# EAGLE schematic scoreboard1 (EAGLE 7.2.0)

## Sheet 1 of 2
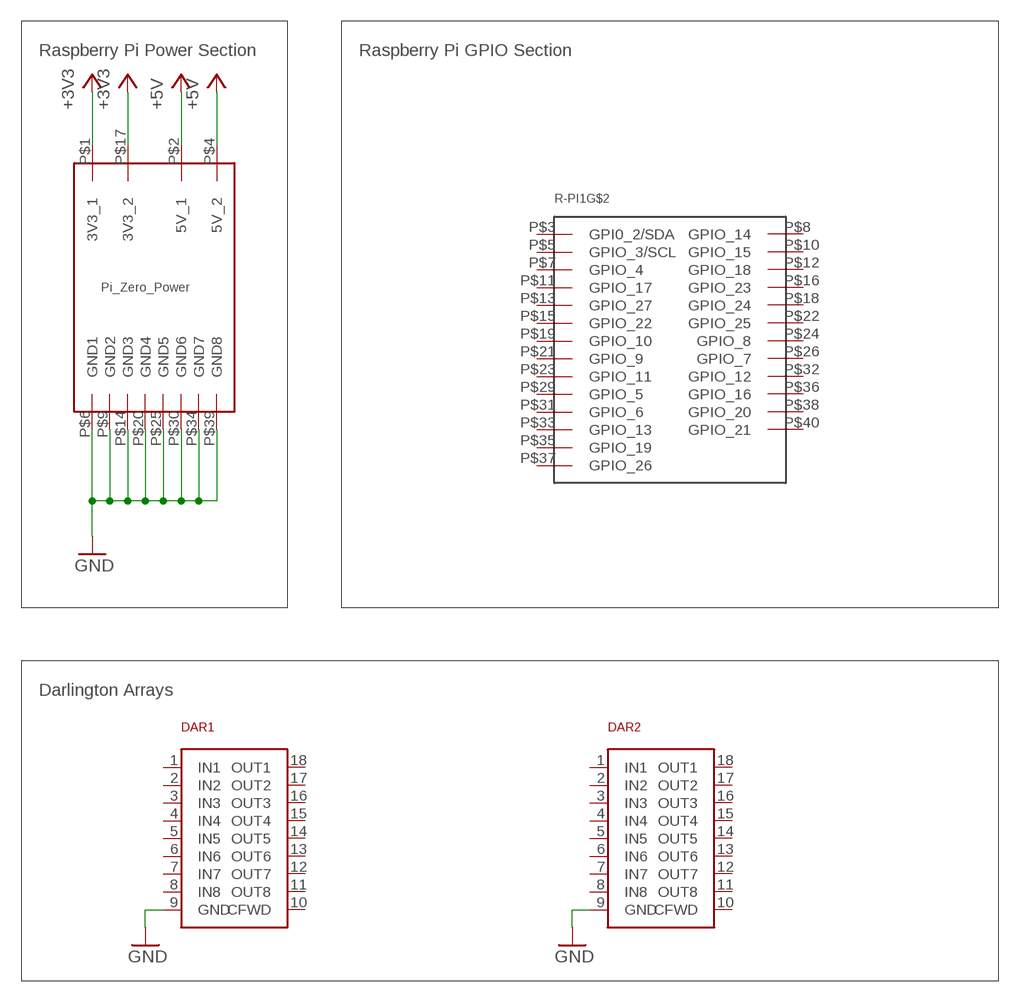
[diagram p0: schematic, sheet 1]

### Parts
DAR1  ULN2803A  [DIP18]
DAR2  ULN2803A  [DIP18]
R-PI1  PI_ZERO_POWER_AND_GPIO  [R_PI_ZERO_FOOTPRINT]

### Nets
+3V3: R-PI1.P$1(3V3_1) R-PI1.P$17(3V3_2) ; also sheet 2
+5V: R-PI1.P$2(5V_1) R-PI1.P$4(5V_2)
GND: DAR1.9(GND) DAR2.9(GND) R-PI1.P$6(GND1) R-PI1.P$9(GND2) R-PI1.P$14(GND3) R-PI1.P$20(GND4) R-PI1.P$25(GND5) R-PI1.P$30(GND6) R-PI1.P$34(GND7) R-PI1.P$39(GND8) ; also sheet 2
Unconnected: DAR1.1(IN1) DAR1.2(IN2) DAR1.3(IN3) DAR1.4(IN4) DAR1.5(IN5) DAR1.6(IN6) DAR1.7(IN7) DAR1.8(IN8) DAR1.10(CFWD) DAR1.11(OUT8) DAR1.12(OUT7) DAR1.13(OUT6) DAR1.14(OUT5) DAR1.15(OUT4) DAR1.16(OUT3) DAR1.17(OUT2) DAR1.18(OUT1) DAR2.1(IN1) DAR2.2(IN2) DAR2.3(IN3) DAR2.4(IN4) DAR2.5(IN5) DAR2.6(IN6) DAR2.7(IN7) DAR2.8(IN8) DAR2.10(CFWD) DAR2.11(OUT8) DAR2.12(OUT7) DAR2.13(OUT6) DAR2.14(OUT5) DAR2.15(OUT4) DAR2.16(OUT3) DAR2.17(OUT2) DAR2.18(OUT1) R-PI1.P$3(GPI0_2/SDA) R-PI1.P$5(GPIO_3/SCL) R-PI1.P$7(GPIO_4) R-PI1.P$8(GPIO_14) R-PI1.P$10(GPIO_15) R-PI1.P$11(GPIO_17) R-PI1.P$12(GPIO_18) R-PI1.P$13(GPIO_27) R-PI1.P$15(GPIO_22) R-PI1.P$16(GPIO_23) R-PI1.P$18(GPIO_24) R-PI1.P$19(GPIO_10) R-PI1.P$21(GPIO_9) R-PI1.P$22(GPIO_25) R-PI1.P$23(GPIO_11) R-PI1.P$24(GPIO_8) R-PI1.P$26(GPIO_7) R-PI1.P$29(GPIO_5) R-PI1.P$31(GPIO_6) R-PI1.P$32(GPIO_12) R-PI1.P$33(GPIO_13) R-PI1.P$35(GPIO_19) R-PI1.P$36(GPIO_16) R-PI1.P$37(GPIO_26) R-PI1.P$38(GPIO_20) R-PI1.P$40(GPIO_21)

### Notes on the sheet
- Raspberry Pi Power Section | Raspberry Pi GPIO Section
- Darlington Arrays

## Sheet 2 of 2
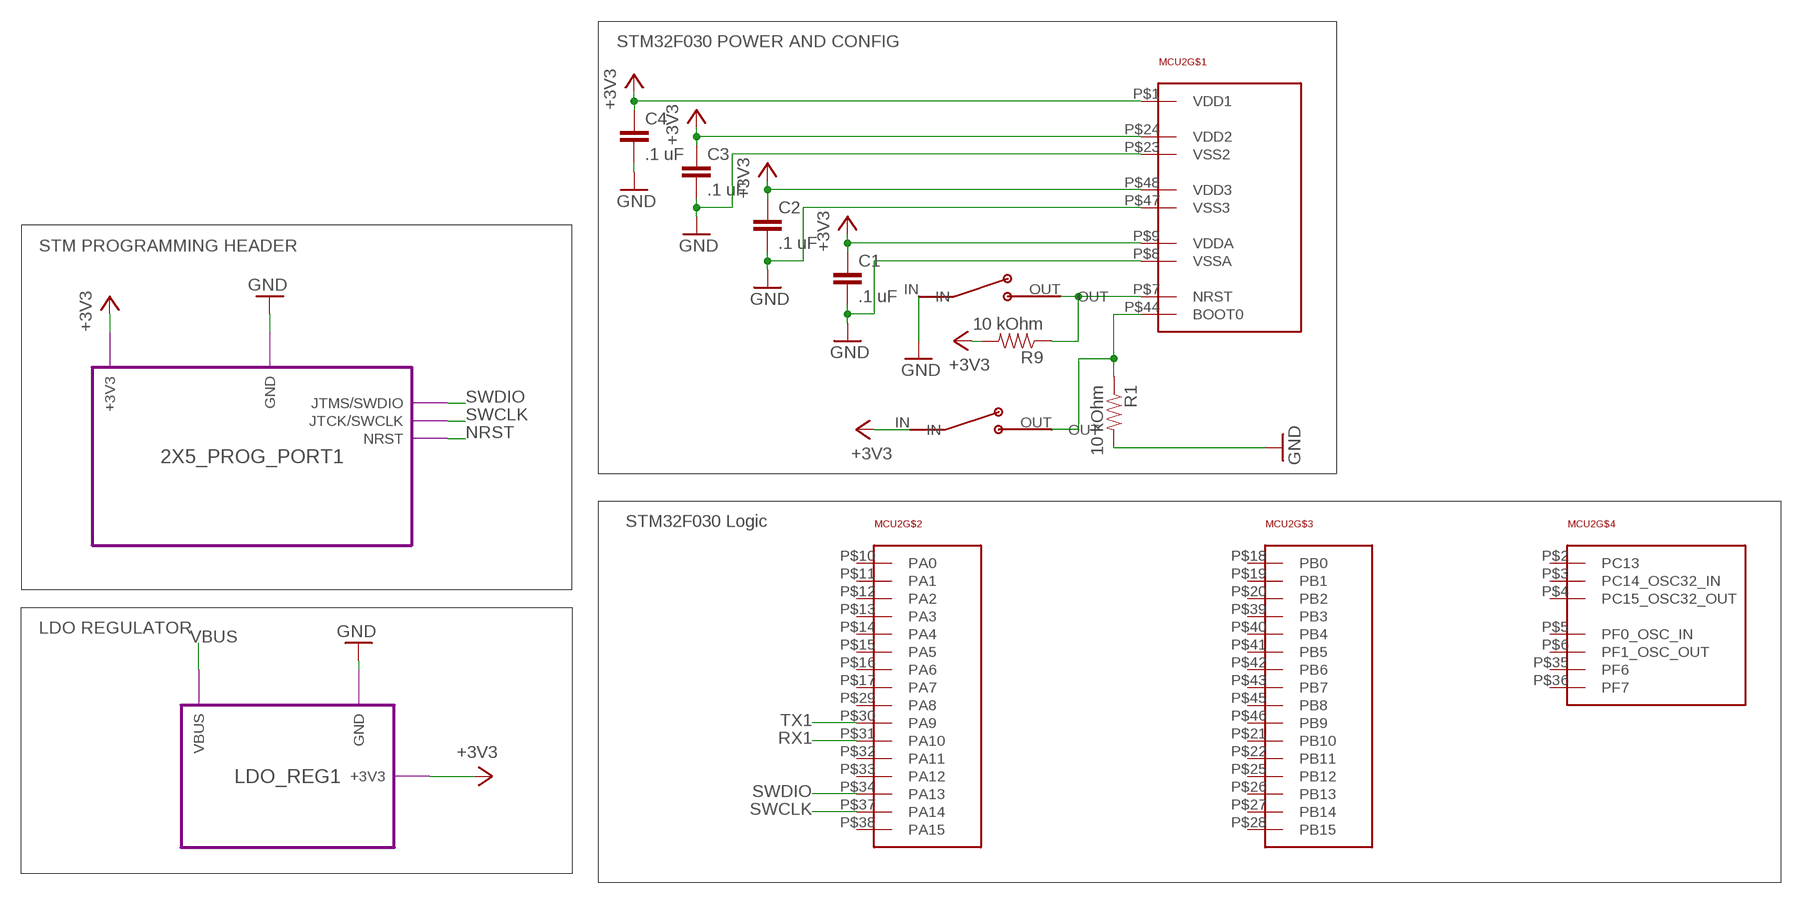
[diagram p1: schematic, sheet 2]

### Parts
BOOT0  OMRON_B3U-1000P-B  [B3U-1000P-B]
BOOT1  OMRON_B3U-1000P-B  [B3U-1000P-B]
C1  .1 uF  0402_CAP_NON_POLAR  [0402_CAP]
C2  .1 uF  0402_CAP_NON_POLAR  [0402_CAP]
C3  .1 uF  0402_CAP_NON_POLAR  [0402_CAP]
C4  .1 uF  0402_CAP_NON_POLAR  [0402_CAP]
MCU2  STM32F030C6TCTR  [LQFP-48]
R1  10 kOhm  0402_RESISTOR  [0402_RES]
R9  10 kOhm  0402_RESISTOR  [0402_RES]

### Module instances
2X5_PROG_PORT1 = 2X5_PROG_PORT
LDO_REG1 = LDO_REG

### Nets
+3V3: BOOT1.IN C1.P$1 C2.P$1 C3.P$1 C4.P$1 MCU2.P$1(VDD1) MCU2.P$9(VDDA) MCU2.P$24(VDD2) MCU2.P$48(VDD3) R9.P$2 ; port 2X5_PROG_PORT1.+3V3 LDO_REG1.+3V3 ; also sheet 1
GND: BOOT0.IN C1.P$2 C2.P$2 C3.P$2 C4.P$2 MCU2.P$8(VSSA) MCU2.P$23(VSS2) MCU2.P$47(VSS3) R1.P$2 ; port 2X5_PROG_PORT1.GND LDO_REG1.GND ; also sheet 1
NRST: BOOT0.OUT MCU2.P$7(NRST) R9.P$1 ; port 2X5_PROG_PORT1.NRST
NRST1: BOOT1.OUT MCU2.P$44(BOOT0) R1.P$1
RX1: MCU2.P$31(PA10)
SWCLK: MCU2.P$37(PA14) ; port 2X5_PROG_PORT1.JTCK/SWCLK
SWDIO: MCU2.P$34(PA13) ; port 2X5_PROG_PORT1.JTMS/SWDIO
TX1: MCU2.P$30(PA9)
VBUS: port LDO_REG1.VBUS
Unconnected: MCU2.P$2(PC13) MCU2.P$3(PC14_OSC32_IN) MCU2.P$4(PC15_OSC32_OUT) MCU2.P$5(PF0_OSC_IN) MCU2.P$6(PF1_OSC_OUT) MCU2.P$10(PA0) MCU2.P$11(PA1) MCU2.P$12(PA2) MCU2.P$13(PA3) MCU2.P$14(PA4) MCU2.P$15(PA5) MCU2.P$16(PA6) MCU2.P$17(PA7) MCU2.P$18(PB0) MCU2.P$19(PB1) MCU2.P$20(PB2) MCU2.P$21(PB10) MCU2.P$22(PB11) MCU2.P$25(PB12) MCU2.P$26(PB13) MCU2.P$27(PB14) MCU2.P$28(PB15) MCU2.P$29(PA8) MCU2.P$32(PA11) MCU2.P$33(PA12) MCU2.P$35(PF6) MCU2.P$36(PF7) MCU2.P$38(PA15) MCU2.P$39(PB3) MCU2.P$40(PB4) MCU2.P$41(PB5) MCU2.P$42(PB6) MCU2.P$43(PB7) MCU2.P$45(PB8) MCU2.P$46(PB9)

### Notes on the sheet
- STM32F030 POWER AND CONFIG
- STM PROGRAMMING HEADER
- STM32F030 Logic
- LDO REGULATOR

## Library data of the parts
BOOT0 BOOT1 = omron_b3u:OMRON_B3U-1000P-B: Momentary Tactile Switch
C1-C4 = passives_lean:0402_CAP_NON_POLAR: 0402 capacitor non-polar
DAR1 DAR2 = ULN2803:ULN2803A: Darlington Transistor Array ULN2803A
MCU2 = stm32f030:STM32F030C6TCTR
R1 R9 = passives_lean:0402_RESISTOR: 0402 resistor
R-PI1 = raspberry_pi_w:PI_ZERO_POWER_AND_GPIO: R-Pi Zero

## Module LDO_REG
Ports: VBUS(io) GND(io) +3V3(io)
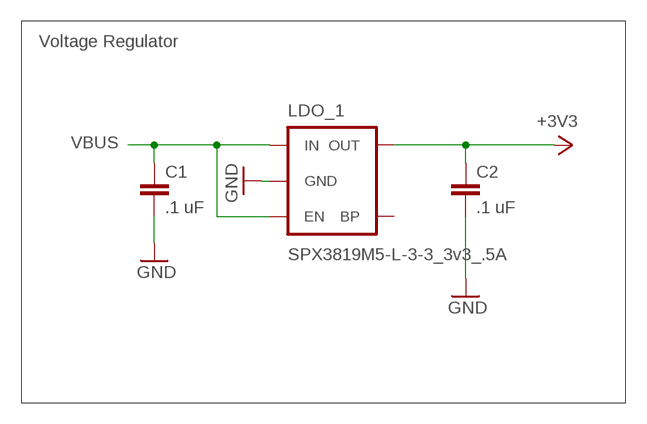
[diagram p2: schematic, module LDO_REG, sheet 1]

### Parts
C1  .1 uF  0402_CAP_NON_POLAR  [0402_CAP]
C2  .1 uF  0402_CAP_NON_POLAR  [0402_CAP]
LDO_1  SPX3819M5-L-3-3_3v3_.5A  V_REG_LDOSMD  [SOT23-5]

### Nets
+3V3: C2.P$1 LDO_1.5(OUT)
GND: C1.P$2 C2.P$2 LDO_1.2(GND)
VBUS: C1.P$1 LDO_1.1(IN) LDO_1.3(EN)
Unconnected: LDO_1.4(BP)

### Notes on the sheet
- Voltage Regulator

### Library data of the parts
C1 C2 = passives_lean:0402_CAP_NON_POLAR: 0402 capacitor non-polar
LDO_1 = SparkFun-PowerIC:V_REG_LDO: Voltage Regulator LDO Standard 150mA LDO voltage regulator in SOT-23 layout. Micrel part MIC5205. BP (by-pass) pin is used to lower output noise with 470pF cap.

## Module 2X5_PROG_PORT
Ports: +3V3(io) GND(io) JTMS/SWDIO(io) JTCK/SWCLK(io) NRST(io)
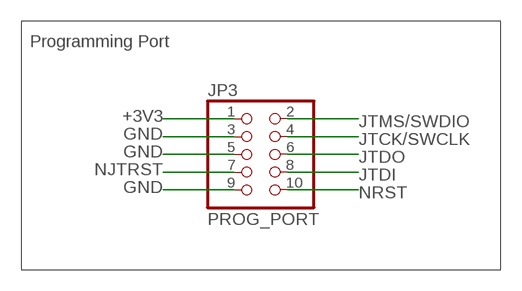
[diagram p3: schematic, module 2X5_PROG_PORT, sheet 1]

### Parts
JP3  PROG_PORT  PINHD-2X5  [2X05]

### Nets
+3V3: JP3.1
GND: JP3.3 JP3.5 JP3.9
JTCK/SWCLK: JP3.4
JTDI: JP3.8
JTDO: JP3.6
JTMS/SWDIO: JP3.2
NJTRST: JP3.7
NRST: JP3.10

### Notes on the sheet
- Programming Port

### Library data of the parts
JP3 = pinhead:PINHD-2X5: PIN HEADER